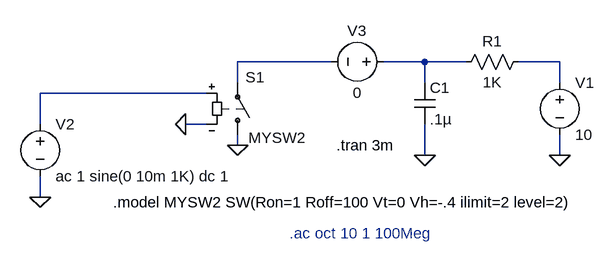
[diagram p0: schematic NewVswitchAC.asc]
NewVswitchAC.asc, the LTspice schematic file:
Version 4
SHEET 1 1276 680
WIRE 384 112 240 112
WIRE 528 112 464 112
WIRE 592 112 528 112
WIRE 736 112 672 112
WIRE 240 144 240 112
WIRE 528 144 528 112
WIRE 736 144 736 112
WIRE 192 160 -64 160
WIRE -64 208 -64 160
WIRE 192 208 160 208
WIRE 240 240 240 224
WIRE 528 256 528 208
WIRE 736 256 736 224
WIRE -64 320 -64 288
FLAG -64 320 0
FLAG 736 256 0
FLAG 240 240 0
FLAG 160 208 0
FLAG 528 256 0
SYMBOL voltage 736 128 R0
SYMATTR Value 10
SYMATTR InstName V1
SYMBOL sw 240 240 M180
WINDOW 0 12 104 Left 2
WINDOW 3 17 11 Left 2
SYMATTR InstName S1
SYMATTR Value MYSW2
SYMBOL voltage -64 192 R0
SYMATTR InstName V2
SYMATTR Value ac 1 sine(0 10m 1K) dc 1
SYMBOL res 688 96 R90
WINDOW 0 0 56 VBottom 2
WINDOW 3 32 56 VTop 2
SYMATTR InstName R1
SYMATTR Value 1K
SYMBOL cap 512 144 R0
SYMATTR InstName C1
SYMATTR Value .1µ
SYMBOL voltage 480 112 R90
WINDOW 0 -32 56 VBottom 2
WINDOW 3 32 56 VTop 2
SYMATTR InstName V3
SYMATTR Value 0
TEXT 48 328 Left 2 !.model MYSW2 SW(Ron=1 Roff=100 Vt=0 Vh=-.4 ilimit=2 level=2)
TEXT 320 376 Left 2 ;.ac oct 10 1 100Meg
TEXT 392 240 Left 2 !.tran 3m

The netlist it stands for:
* NewVswitchAC.asc
V1 N003 0 10
S1 0 N001 N004 0 MYSW2
V2 N004 0 ac 1 sine(0 10m 1K) dc 1
R1 N003 N002 1K
C1 N002 0 .1µ
V3 N002 N001 0
.model MYSW2 SW(Ron=1 Roff=100 Vt=0 Vh=-.4 ilimit=2 level=2)
* .ac oct 10 1 100Meg
.tran 3m
.backanno
.end